# Altium schematic sheet 6_ALARM.SchDoc: Alarm and sound
size B; Author: Sebastien Gelinas; CompanyName: SmartHalo; Organization: SmartHalo; Address1: 5445 de Gaspé; Address2: Montréal, QC; Address3: Canada; Address4: H2T 3B2; Revision: 1; SheetNumber: 6; SheetTotal: 7
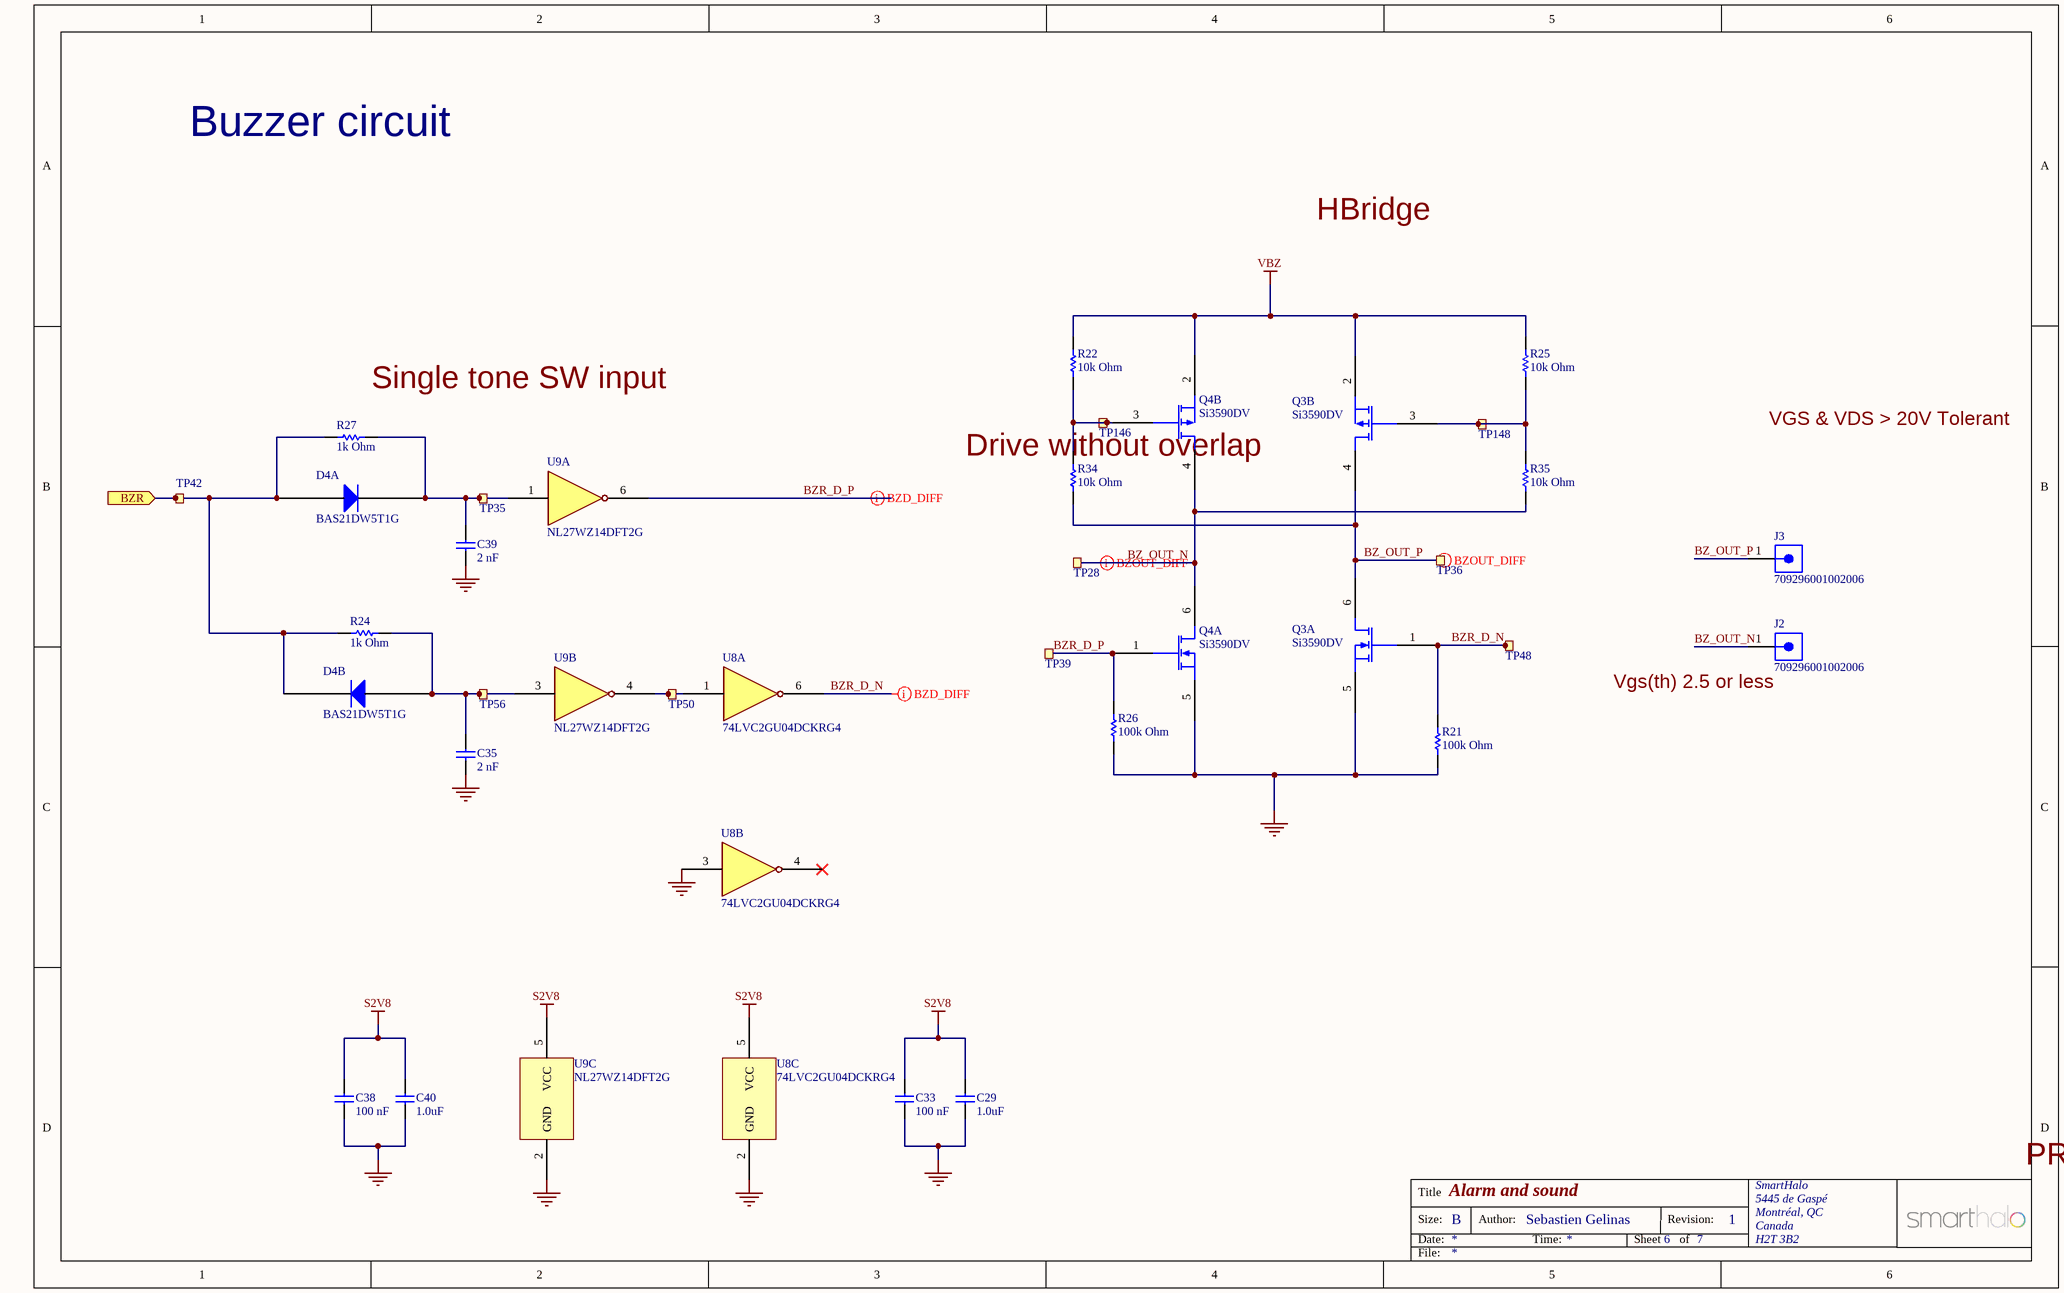
[diagram p0: 6_ALARM.SchDoc]

## Parts
C29  1.0uF  [Varitron_CAP0603]
C33  100 nF  [Varitron_CAP0402]
C35  2 nF  [Varitron_CAP0402]
C38  100 nF  [Varitron_CAP0402]
C39  2 nF  [Varitron_CAP0402]
C40  1.0uF  [Varitron_CAP0603]
D4  BAS21DW5T1G  [SC70-5]  (parts A,B of 2)
J2  709296001002006  [709296001002006]
J3  709296001002006  [709296001002006]
Q3  Si3590DV  [TSOP-6]  (parts A,B of 2)
Q4  Si3590DV  [TSOP-6]  (parts A,B of 2)
R21  100k Ohm  [Varitron_RES0402]
R22  10k Ohm  [Varitron_RES0402]
R24  1k Ohm  [Varitron_RES0402]
R25  10k Ohm  [Varitron_RES0402]
R26  100k Ohm  [Varitron_RES0402]
R27  1k Ohm  [Varitron_RES0402]
R34  10k Ohm  [Varitron_RES0402]
R35  10k Ohm  [Varitron_RES0402]
TP28  (no value)  [TESTPAD-TH-1_5mm]  (no BOM)
TP35  (no value)  [TESTPAD-TH-35mils]  (no BOM)
TP36  (no value)  [TESTPAD-TH-1_5mm]  (no BOM)
TP39  (no value)  [TESTPAD-TH-35mils]  (no BOM)
TP42  (no value)  [TESTPAD-TH-35mils]  (no BOM)
TP48  (no value)  [TESTPAD-TH-35mils]  (no BOM)
TP50  (no value)  [TESTPAD-TH-35mils]  (no BOM)
TP56  (no value)  [TESTPAD-TH-35mils]  (no BOM)
TP146  TP  [TESTPAD-TH-35mils]  (value not drawn)  (no BOM)
TP148  TP  [TESTPAD-TH-35mils]  (value not drawn)  (no BOM)
U8  74LVC2GU04DCKRG4  [SOT363_SC70_6]  (parts A,B,C of 3)
U9  NL27WZ14DFT2G  [SOT363_SC70_6]  (parts A,B,C of 3)

## Ports
BZR (in)

## Nets
GND: C29.2 C33.2 C35.2 C38.2 C39.2 C40.2 Q3.5(S1) Q4.5(S1) R21.1 R26.1 U8.2(GND) U8.3 U9.2(GND)
S2V8: C29.1 C33.1 C38.1 C40.1 U8.5(VCC) U9.5(VCC)
VBZ: Q3.2(S2) Q4.2(S2) R22.2 R25.2
BZ_OUT_N: J2.1 Q4.4(D2) Q4.6(D1) R35.1 TP28.1
BZ_OUT_P: J3.1 Q3.4(D2) Q3.6(D1) R34.1 TP36.1
BZR: D4.1(Anode) D4.4(Cathode) R24.2 R27.2 TP42.1 ; port BZR
BZR_D_N: Q3.1(G1) R21.2 TP48.1 U8.6
BZR_D_P: Q4.1(G1) R26.2 TP39.1 U9.6
NetC35_1: C35.1 D4.3(Anode) R24.1 TP56.1 U9.3
NetC39_1: C39.1 D4.5(Cathode) R27.1 TP35.1 U9.1
NetQ3_3: Q3.3(G2) R25.1 R35.2 TP148.1
NetQ4_3: Q4.3(G2) R22.1 R34.2 TP146.1
NetTP50_1: TP50.1 U8.1 U9.4

Not connected (* = marked no-connect by the designer): D4 2; U8 4*

## Layout directives
differential pair: BZ_OUT_N, BZ_OUT_P, BZR_D_N, BZR_D_P

## Notes on the sheet
- Buzzer circuit
- HBridge
- (near R27) Single tone SW input
- VGS & VDS > 20V Tolerant
- (near U9) Drive without overlap
- Vgs(th) 2.5 or less
- PRELIMINARY: DO NOT USE FOR PRODUCTION
- Title
- Size:
- Date:
- B
- Author:
- Time:
- Sheet
- Revision:
- of
- File:

## Library data of the parts
C29 C40 = Varitron_CAP0603: 1uF 10V X7R 10% 0603 (1608 Metric)  SMD; Case-EIA: 0603; Case-Metric: 1608; Tolerance: 10%; Technology: SMT; Temperature Coefficient: X7R; Voltage Rating: 10V; Value: 1.0uF
C33 C38 = Varitron_CAP0402: 100 nF 10V X7R 10% 0402 (1005 Metric)  SMD; Case-EIA: 0402; Case-Metric: 1005; Tolerance: 10%; Technology: SMT; Temperature Coefficient: X7R; Voltage Rating: 10V; Value: 100 nF
C35 C39 = Varitron_CAP0402: 2 nF 6V X5R 10% 0402 (1005 Metric)  SMD; Case-EIA: 0402; Case-Metric: 1005; Tolerance: 10%; Technology: SMT; Temperature Coefficient: X5R; Voltage Rating: 6V; Value: 2 nF
D4 = BAS21DW5T1G: High Voltage Switching Diode; Manufacturer: ON Semiconductor; Manufacturer Part Number: BAS21DW5T1G; Part Number: BAS21DW5T1G
J2 J3 = 709296001002006: Connector, Single Horizontal Contact, 2 x 2 mm; Manufacturer: AVX; Manufacturer Part Number: 709296001002006; Part Number: 709296001002006
Q3 Q4 = Si3590DV: N and P Channel 30 V MOSFET; Manufacturer: Vishay; Manufacturer Part Number: Si3590DV; Part Number: Si3590DV
R21 R26 = Varitron_RES0402: 100K 0.063W 5% 0402 (1005 Metric)  SMD; Case-Metric: 1005; Case-EIA: 0402; Tolerance: 5%; Technology: SMT; Power: 0.063W; Value: 100k Ohm
R22 R25 R34 R35 = Varitron_RES0402: 10K 0.063W 5% 0402 (1005 Metric)  SMD; Case-Metric: 1005; Case-EIA: 0402; Tolerance: 5%; Technology: SMT; Power: 0.063W; Value: 10k Ohm
R24 R27 = Varitron_RES0402: 1K 0.063W 5%  0402 (1005 Metric)  SMD; Case-Metric: 1005; Case-EIA: 0402; Tolerance: 5%; Technology: SMT; Power: 0.063W; Value: 1k Ohm
TP28 TP36 = TESTPAD_TH_1_5MM: Testpoint, through hole, 1.5mm; Value: TP
TP35 TP39 TP42 TP48 TP50 TP56 = TESTPAD_TH_35mils: Testpoint, through hole, 35 mils; Value: TP
TP146 TP148 = TESTPAD_TH_35mils: Testpoint, through hole, 35 mils; Value: TP
U8 = 74LVC2GU04DCKRG4: Dual Inverter Gate; Manufacturer: Texas Instruments; Manufacturer Part Number: 74LVC2GU04DCKRG4; Part Number: 74LVC2GU04DCKRG4
U9 = NL27WZ14DFT2G: IC Dual Inverter with Schmitt Trigger Inputs; Manufacturer: ON Semiconductor; Manufacturer Part Number: NL27WZ14DFT2G; Part Number: NL27WZ14DFT2G